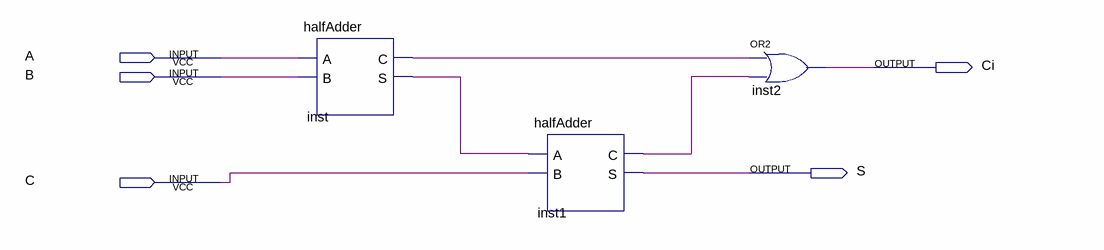
[diagram p0: schematic sheet]
// Quartus schematic fullAdder.bdf as structural Verilog: 3 symbols, 5 pins
module fullAdder (
  input  A,
  input  B,
  input  C,
  output Ci,
  output S
);

  wire inst1_c, inst_c, inst_s;

  halfAdder inst (.A(A), .B(B), .C(inst_c), .S(inst_s));
  halfAdder inst1 (.A(inst_s), .B(C), .C(inst1_c), .S(S));
  or inst2 (Ci, inst_c, inst1_c);
endmodule
